# Altium schematic sheet Valve.SchDoc
size A3
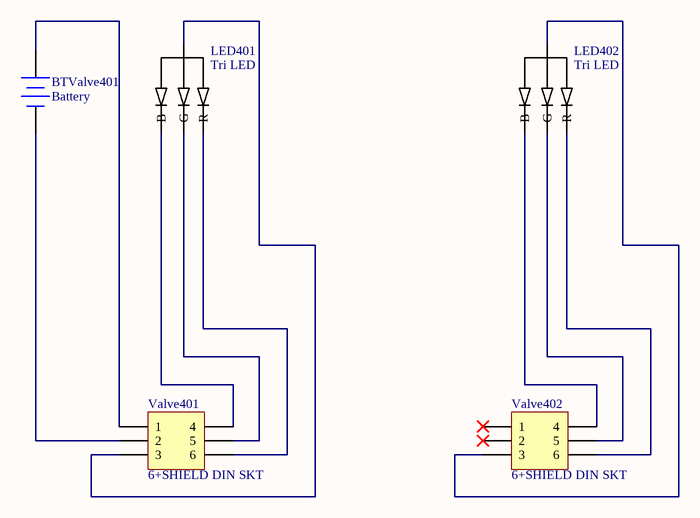
[diagram p0: Valve.SchDoc]

## Parts
BTValve401  Battery  [BAT-2]
LED401  Tri LED  [CLV1A-FKB]
LED402  Tri LED  [CLV1A-FKB]
Valve401  6+SHIELD DIN SKT  [Valve male]
Valve402  6+SHIELD DIN SKT  [Valve male]

## Nets
NetBTValve401_1: BTValve401.1(+) Valve401.1
NetBTValve401_2: BTValve401.2(-) Valve401.2
NetLED401_1: LED401.1(R) Valve401.6
NetLED401_2: LED401.2(Common) Valve401.3
NetLED401_3: LED401.3(B) Valve401.4
NetLED401_4: LED401.4(G) Valve401.5
NetLED402_1: LED402.1(R) Valve402.6
NetLED402_2: LED402.2(Common) Valve402.3
NetLED402_3: LED402.3(B) Valve402.4
NetLED402_4: LED402.4(G) Valve402.5

Not connected (* = marked no-connect by the designer): Valve402 1* 2*

## Library data of the parts
BTValve401 = Battery: Multicell Battery; Published: 24-Mar-1999; LatestRevisionDate: 17-Jul-2002; LatestRevisionNote: Re-released for DXP Platform.; PackageReference: BAT-2; Publisher: Altium Limited
Valve401 Valve402 = Header 3X2A: Header, 3-Pin, Dual row; LatestRevisionDate: 17-Jul-2002; LatestRevisionNote: Re-released for DXP Platform.; Publisher: Altium Limited